# Altium schematic sheet EVB-NORA-B2_SCHEM_0002_NORA_Module.SchDoc: UBX_NORA_B1_SCHEM_0001_NORA_B1_Module
size A3; Date: 7/24/2020; CompanyName: U-blox; DrawnBy: EMOO; Engineer: EMOO; Organization: U-blox; Address1: 3950 Fairview Industrial Dr SE #100; Address2: Salem, OR 97302; DocumentNumber: 3; SheetNumber: 3; SheetTotal: 8; Website: www.u-blox.com; SheetSize: B
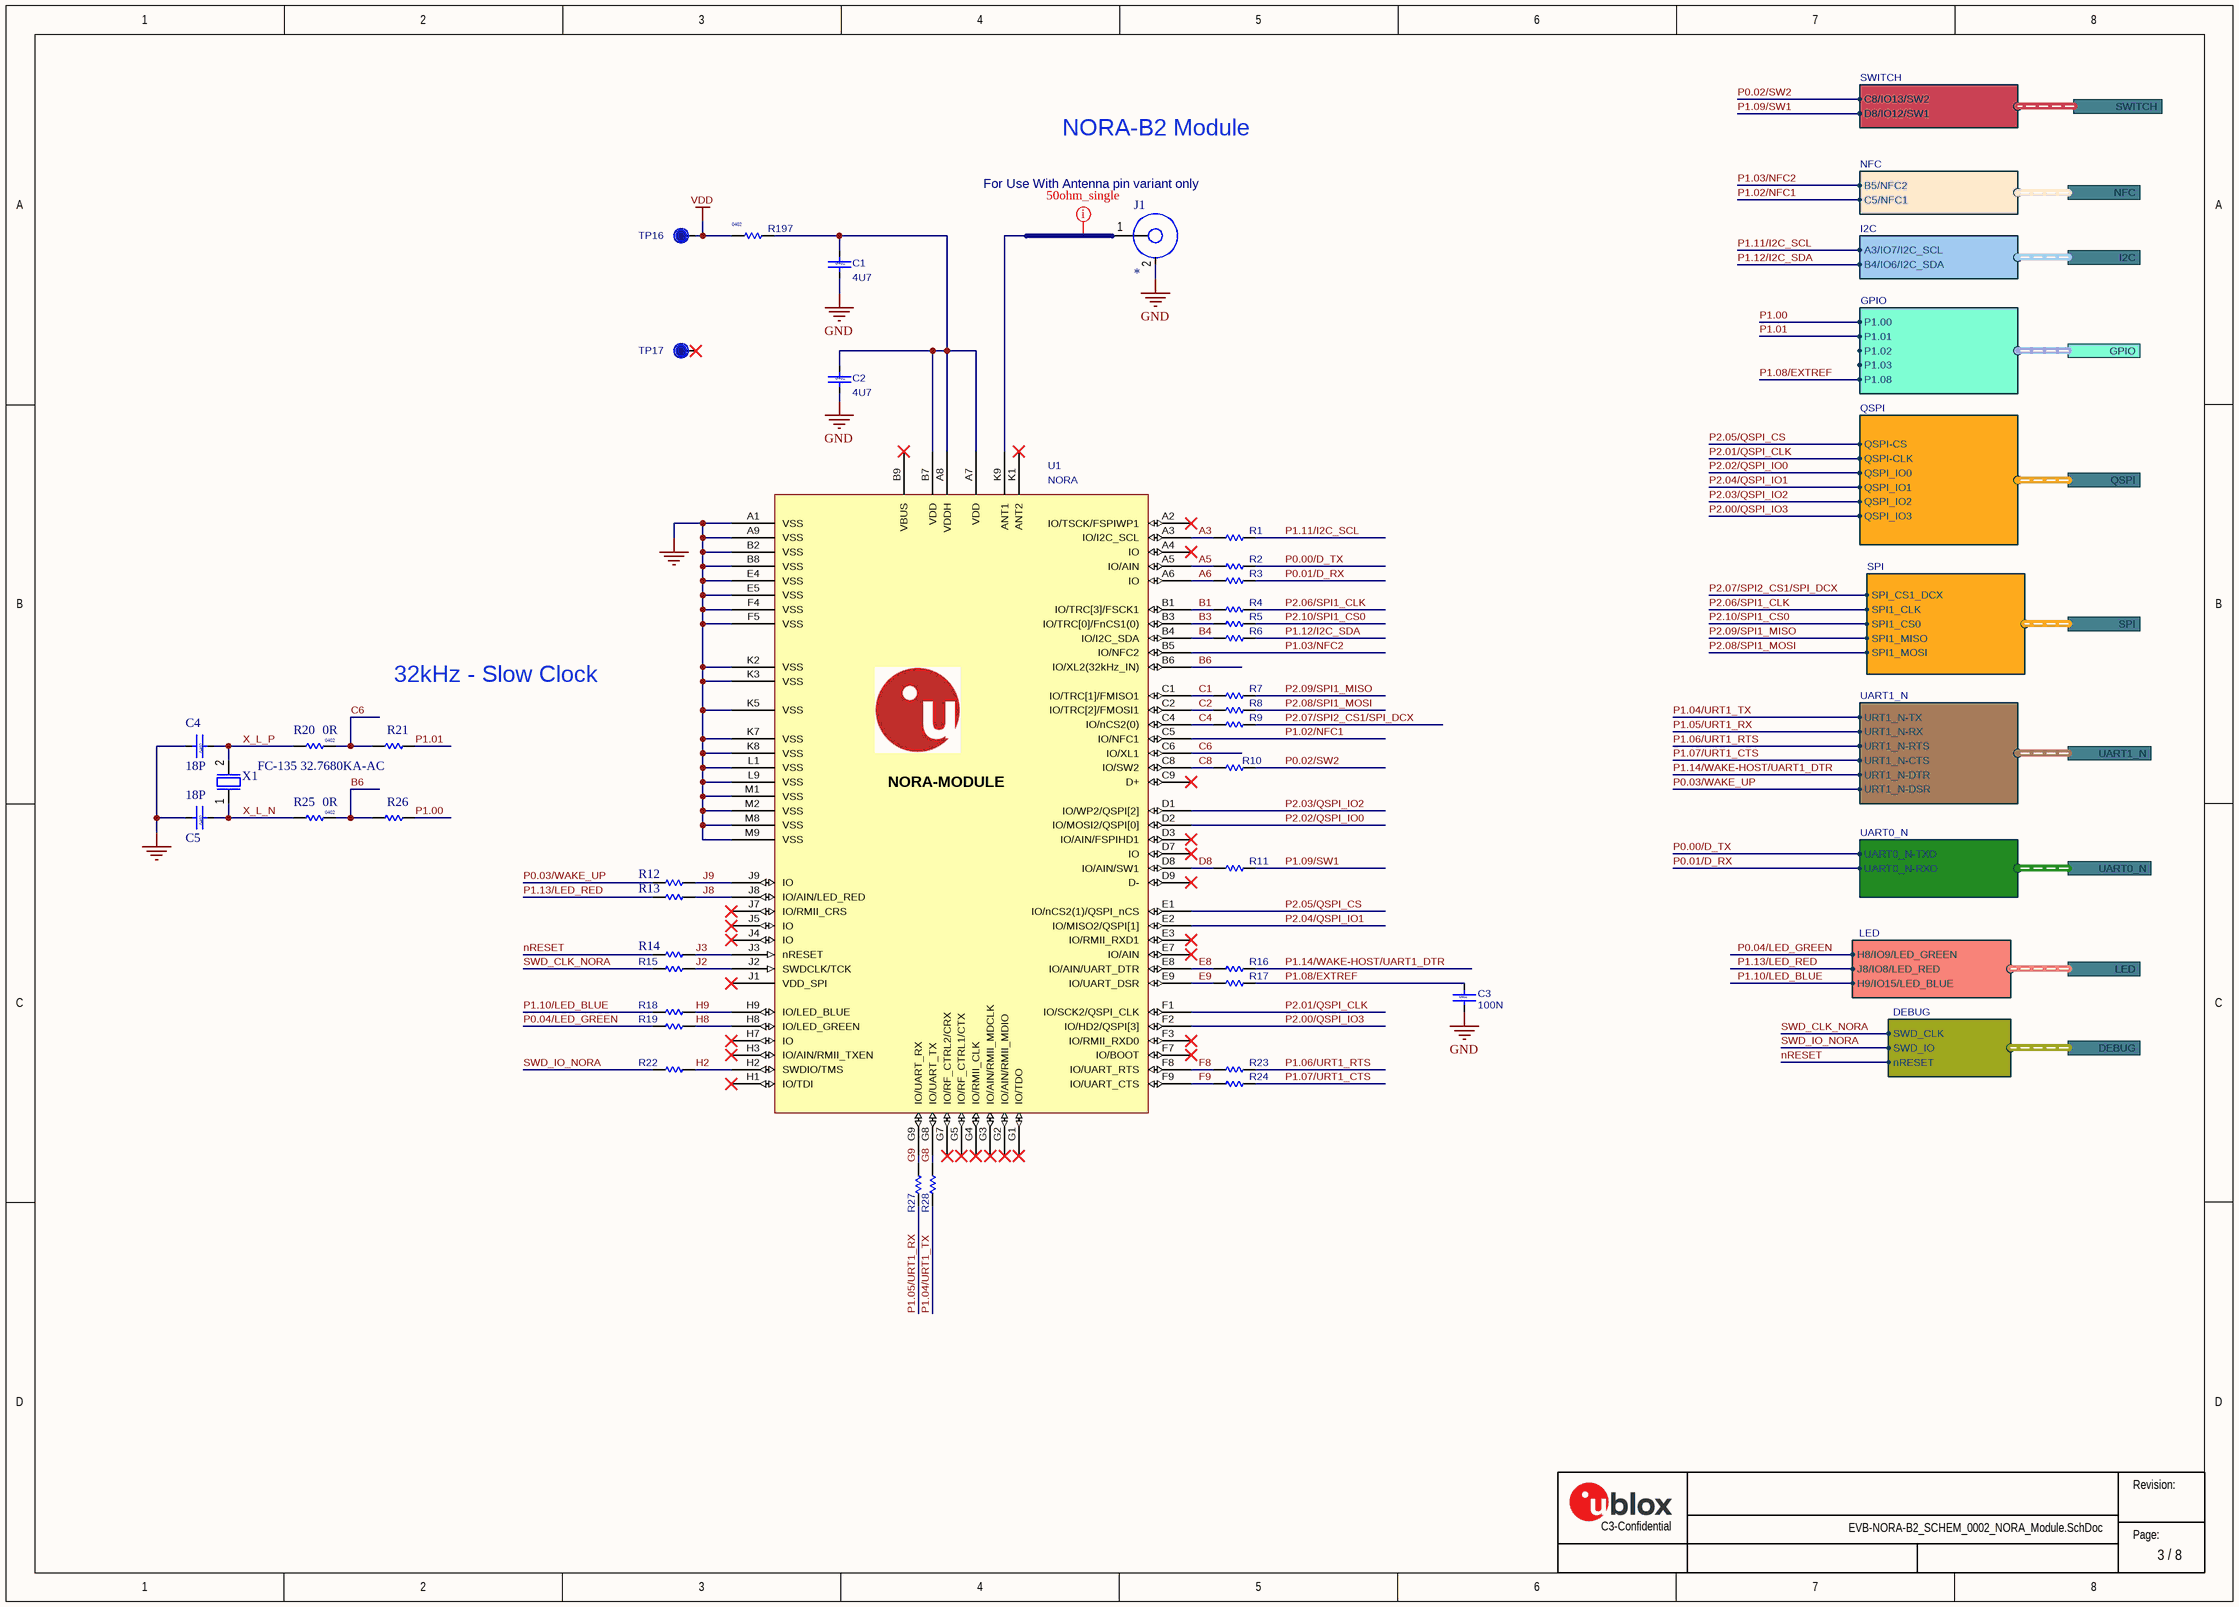
[diagram p0: EVB-NORA-B2_SCHEM_0002_NORA_Module.SchDoc]

## Parts
C1  value 4U7  Size: 0402  [Cap 0402 HD]  (hidden comment: UBXH01-0000243)
C2  value 4U7  Size: 0402  [Cap 0402 HD]  (hidden comment: UBXH01-0000243)
C3  value 100N  Size: 0402  [Cap 0402 HD]  (hidden comment: UBXH01-2021002)
C4  value 18P  Size: 0402  [Cap_0402_1100Lx600Wx600H_600x600Pad_350G_FLX]  (hidden comment: UBXH01-0004017)
C5  value 18P  Size: 0402  [Cap_0402_1100Lx600Wx600H_600x600Pad_350G_FLX]  (hidden comment: UBXH01-0004017)
J1  130-00067  [U.FL_3Pin]  (value not drawn)
R1  UBXH18-0003002  [RES 0402 HD]  (value not drawn)
R2  UBXH18-0003002  [RES 0402 HD]  (value not drawn)
R3  UBXH18-0003002  [RES 0402 HD]  (value not drawn)
R4  UBXH18-0003002  [RES 0402 HD]  (value not drawn)
R5  UBXH18-0003002  [RES 0402 HD]  (value not drawn)
R6  UBXH18-0003002  [RES 0402 HD]  (value not drawn)
R7  UBXH18-0003002  [RES 0402 HD]  (value not drawn)
R8  UBXH18-0003002  [RES 0402 HD]  (value not drawn)
R9  UBXH18-0003002  [RES 0402 HD]  (value not drawn)
R10  UBXH18-0003002  [RES 0402 HD]  (value not drawn)
R11  UBXH18-0003002  [RES 0402 HD]  (value not drawn)
R12  UBXH18-0003002  [RES_0402_1100Lx600Wx400H_500x600Pad_400G_FLX]  (value not drawn)
R13  UBXH18-0003002  [RES_0402_1100Lx600Wx400H_500x600Pad_400G_FLX]  (value not drawn)
R14  UBXH18-0003002  [RES_0402_1100Lx600Wx400H_500x600Pad_400G_FLX]  (value not drawn)
R15  UBXH18-0003002  [RES 0402 HD]  (value not drawn)
R16  UBXH18-0003002  [RES 0402 HD]  (value not drawn)
R17  UBXH18-0003002  [RES 0402 HD]  (value not drawn)
R18  UBXH18-0003002  [RES 0402 HD]  (value not drawn)
R19  UBXH18-0003002  [RES 0402 HD]  (value not drawn)
R20  value 0R  Size: 0402  [RES 0402 HD]  (hidden comment: UBXH18-0003002)
R21  UBXH18-0003002  [RES_0402_1100Lx600Wx400H_500x600Pad_400G_FLX]  (value not drawn)
R22  UBXH18-0003002  [RES 0402 HD]  (value not drawn)
R23  UBXH18-0003002  [RES 0402 HD]  (value not drawn)
R24  UBXH18-0003002  [RES 0402 HD]  (value not drawn)
R25  value 0R  Size: 0402  [RES 0402 HD]  (hidden comment: UBXH18-0003002)
R26  UBXH18-0003002  [RES_0402_1100Lx600Wx400H_500x600Pad_400G_FLX]  (value not drawn)
R27  UBXH18-0003002  [RES 0402 HD]  (value not drawn)
R28  UBXH18-0003002  [RES 0402 HD]  (value not drawn)
R197  Size: 0402  [RES 0402 HD]  (hidden comment: UBXH18-0003002)
TP16  TP10R  [TP10R]  (value not drawn)  (no BOM)
TP17  TP10R  [TP10R]  (value not drawn)  (no BOM)
U1  NORA  [NORA_LGA82R_1430X1040X180_ANT]
X1  Manufacturer P/N: FC-135 32.7680KA-AC  [XTAL_3215]  (hidden comment: UBXH21-0008104)

## Ports
DEBUG (harness Debug), GPIO (harness GPIO), I2C (harness I2C), LED (harness LED), NFC (harness NFC), QSPI (harness QSPI), SPI (harness SPI), SWITCH (harness SWITCH), UART0_N (harness UART0_N), UART1_N (harness UART1_N)

## Harnesses
DEBUG: nRESET, SWD_IO, SWD_CLK
UART1_N: URT1_N-RTS, URT1_N-CTS, URT1_N-TX, URT1_N-RX, URT1_N-DTR, URT1_N-DSR
QSPI: QSPI-CS, QSPI-CLK, QSPI_IO0, QSPI_IO1, QSPI_IO2, QSPI_IO3
LED: H9/IO15/LED_BLUE, J8/IO8/LED_RED, H8/IO9/LED_GREEN
I2C: A3/IO7/I2C_SCL, B4/IO6/I2C_SDA
NFC: B5/NFC2, C5/NFC1
SWITCH: C8/IO13/SW2, D8/IO12/SW1
GPIO: P1.00, P1.01, P1.02, P1.08, P1.03
UART0_N: UART0_N-TXD, UART0_N-RXD
SPI: SPI_CS1_DCX, SPI1_CLK, SPI1_CS0, SPI1_MISO, SPI1_MOSI

## Nets
GND: C1.2 C2.2 C3.1 C4.2 C5.2 J1.2 U1.A1(VSS) U1.A9(VSS) U1.B2(VSS) U1.B8(VSS) U1.E4(VSS) U1.E5(VSS) U1.F4(VSS) U1.F5(VSS) U1.K2(VSS) U1.K3(VSS) U1.K5(VSS) U1.K7(VSS) U1.K8(VSS) U1.L1(VSS) U1.L9(VSS) U1.M1(VSS) U1.M2(VSS) U1.M8(VSS) U1.M9(VSS)
VDD: R197.2 TP16.1
A3: R1.2 U1.A3(IO/I2C_SCL)
A5: R2.2 U1.A5(IO/AIN)
A6: R3.2 U1.A6(IO)
B1: R4.2 U1.B1(IO/TRC[3]/FSCK1)
B3: R5.2 U1.B3(IO/TRC[0]/FnCS1(0))
B4: R6.2 U1.B4(IO/I2C_SDA)
B6: R25.2 R26.2 U1.B6(IO/XL2(32kHz_IN))
C1: R7.2 U1.C1(IO/TRC[1]/FMISO1)
C2: R8.2 U1.C2(IO/TRC[2]/FMOSI1)
C4: R9.2 U1.C4(IO/nCS2(0))
C6: R20.2 R21.2 U1.C6(IO/XL1)
C8: R10.2 U1.C8(IO/SW2)
D8: R11.2 U1.D8(IO/AIN/SW1)
E8: R16.2 U1.E8(IO/AIN/UART_DTR)
E9: R17.2 U1.E9(IO/UART_DSR)
F8: R23.2 U1.F8(IO/UART_RTS)
F9: R24.2 U1.F9(IO/UART_CTS)
G8: R28.1 U1.G8(IO/UART_TX)
G9: R27.1 U1.G9(IO/UART_RX)
H2: R22.1 U1.H2(SWDIO/TMS)
H8: R19.1 U1.H8(IO/LED_GREEN)
H9: R18.1 U1.H9(IO/LED_BLUE)
J2: R15.1 U1.J2(SWDCLK/TCK)
J3: R14.1 U1.J3(nRESET)
J8: R13.1 U1.J8(IO/AIN/LED_RED)
J9: R12.1 U1.J9(IO)
nRESET: R14.2 ; port DEBUG.nRESET
P0.00/D_TX: R2.1 ; port UART0_N.UART0_N-TXD
P0.01/D_RX: R3.1 ; port UART0_N.UART0_N-RXD
P0.02/SW2: R10.1 ; port SWITCH.C8/IO13/SW2
P0.03/WAKE_UP: R12.2 ; port UART1_N.URT1_N-DSR
P0.04/LED_GREEN: R19.2 ; port LED.H8/IO9/LED_GREEN
P1.00: R26.1 ; port GPIO.P1.00
P1.01: R21.1 ; port GPIO.P1.01
P1.02/NFC1: U1.C5(IO/NFC1) ; port NFC.C5/NFC1
P1.03/NFC2: U1.B5(IO/NFC2) ; port NFC.B5/NFC2
P1.04/URT1_TX: R28.2 ; port UART1_N.URT1_N-TX
P1.05/URT1_RX: R27.2 ; port UART1_N.URT1_N-RX
P1.06/URT1_RTS: R23.1 ; port UART1_N.URT1_N-RTS
P1.07/URT1_CTS: R24.1 ; port UART1_N.URT1_N-CTS
P1.08/EXTREF: C3.2 R17.1 ; port GPIO.P1.08
P1.09/SW1: R11.1 ; port SWITCH.D8/IO12/SW1
P1.10/LED_BLUE: R18.2 ; port LED.H9/IO15/LED_BLUE
P1.11/I2C_SCL: R1.1 ; port I2C.A3/IO7/I2C_SCL
P1.12/I2C_SDA: R6.1 ; port I2C.B4/IO6/I2C_SDA
P1.13/LED_RED: R13.2 ; port LED.J8/IO8/LED_RED
P1.14/WAKE-HOST/UART1_DTR: R16.1 ; port UART1_N.URT1_N-DTR
P2.00/QSPI_IO3: U1.F2(IO/HD2/QSPI[3]) ; port QSPI.QSPI_IO3
P2.01/QSPI_CLK: U1.F1(IO/SCK2/QSPI_CLK) ; port QSPI.QSPI-CLK
P2.02/QSPI_IO0: U1.D2(IO/MOSI2/QSPI[0]) ; port QSPI.QSPI_IO0
P2.03/QSPI_IO2: U1.D1(IO/WP2/QSPI[2]) ; port QSPI.QSPI_IO2
P2.04/QSPI_IO1: U1.E2(IO/MISO2/QSPI[1]) ; port QSPI.QSPI_IO1
P2.05/QSPI_CS: U1.E1(IO/nCS2(1)/QSPI_nCS) ; port QSPI.QSPI-CS
P2.06/SPI1_CLK: R4.1 ; port SPI.SPI1_CLK
P2.07/SPI2_CS1/SPI_DCX: R9.1 ; port SPI.SPI_CS1_DCX
P2.08/SPI1_MOSI: R8.1 ; port SPI.SPI1_MOSI
P2.09/SPI1_MISO: R7.1 ; port SPI.SPI1_MISO
P2.10/SPI1_CS0: R5.1 ; port SPI.SPI1_CS0
SWD_CLK_NORA: R15.2 ; port DEBUG.SWD_CLK
SWD_IO_NORA: R22.2 ; port DEBUG.SWD_IO
X_L_N: C5.1 R25.1 X1.1
X_L_P: C4.1 R20.1 X1.2
NetC1_1: C1.1 C2.1 R197.1 U1.A7(VDD) U1.A8(VDDH) U1.B7(VDD)
NetJ1_1: J1.1(ANT) U1.K9(ANT1)

Not connected (* = marked no-connect by the designer): TP17 1*; U1 A2(IO/TSCK/FSPIWP1)* A4(IO)* B9(VBUS)* C9(D+)* D3(IO/AIN/FSPIHD1)* D7(IO)* D9(D-)* E3(IO/RMII_RXD1)* E7(IO/AIN)* F3(IO/RMII_RXD0)* F7(IO/BOOT)* G1(IO/TDO)* G2(IO/AIN/RMII_MDIO)* G3(IO/AIN/RMII_MDCLK)* G4(IO/RMII_CLK)* G5(IO/RF_CTRL1/CTX)* G7(IO/RF_CTRL2/CRX)* H1(IO/TDI)* H3(IO/AIN/RMII_TXEN)* H7(IO)* J1(VDD_SPI)* J4(IO)* J5(IO)* J7(IO/RMII_CRS)* K1(ANT2)*

## Layout directives
net class 50_ohm_se: NetJ1_1

## Notes on the sheet
- (near J1) For Use With Antenna pin variant only
- NORA-B2 Module
- 32kHz - Slow Clock
- Revision:
- C3-Confidential
- Page:
- (in symbol NORA-MODULE_ALT) NORA-MODULE

## Library data of the parts
C1 C2 = UBXH01-0000243: CAP CER X5R 0402 4U7 20% 10V; Manufacturer: Murata Manufacturing Company, Ltd.; Manufacturer P/N: GRM155R61A475MEAA; Editor: martin.pilik; Released by: fabrice.bret-dibat; Env: GREEN; Permitted Use: Volume Products; Perferred: PREF; Mfg P/N Status: Active; Mfg P/N Split: 100; Mfg P/N Released: Yes; Part Number: UBXH01-0000243; Tolerance: 20%; Max Voltage: 10V; Min Operating Temp: -40°C; Max Operating Temp: 85°C; Part Type: Capacitor; Release Data: 2021-05-10 12:57:47.325652; UBX Wiki: https://wiki.u-blox.com/bin/view/Operations/PartDetails?index=24303; RefDes: C; Mfg P/N Datasheet: https://wiki.u-blox.com/bin/view/Generic/Docs/DocumentSummary?index=24302
C3 = UBXH01-2021002: CAP CER X5R 0402 100N 10% 10V; Manufacturer: Murata Manufacturing Company, Ltd.; Manufacturer P/N: GRM155R61A104KA01; Editor: roland.rust; Env: GREEN; Permitted Use: Volume Products; Perferred: PREF; Mfg P/N Status: NRND; Mfg P/N Split: 100; Mfg P/N Released: Yes; Part Number: UBXH01-2021002; Tolerance: 10%; Max Voltage: 10V; Part Type: Capacitor; Released by: roland.rust; Release Data: 2005-07-22T13:59:44; UBX Wiki: https://wiki.u-blox.com/bin/view/Operations/PartDetails?index=5759; RefDes: C; Manufacturer 2: Samsung Electro-Mechanics; Manufacturer P/N 2: CL05A104KP5NNN; Mfg P/N Status 2: Active; Mfg P/N Split 2: 0; Mfg P/N Released 2: Yes; Mfg P/N Datasheet 2: https://wiki.u-blox.com/bin/view/Generic/Docs/DocumentSummary?index=28113
C4 C5 = UBXH01-0004017: CAP CER C0G 0402 18P 5% 25V; Manufacturer: Murata Manufacturing Company, Ltd.; Manufacturer P/N: GRM1555C1H180JA01; Editor: doris.zahnd; Env: ROHS; Permitted Use: Volume Products; Perferred: PREF; Mfg P/N Status: NRND; Mfg P/N Split: 100; Mfg P/N Released: Yes; Released by: daniel.hurni; Part Number: UBXH01-0004017; Tolerance: 5%; Max Voltage: 25V; Min Operating Temp: -55°C; Max Operating Temp: 125°C; Part Type: Capacitor; UBX Wiki: https://wiki.u-blox.com/bin/view/Operations/PartDetails?index=5178; RefDes: C; Release Data: 2009-12-03T17:48:42; Manufacturer 2: Murata Manufacturing Company, Ltd.; Manufacturer P/N 2: GRM1555C1E180JZ01; Mfg P/N Status 2: Obsolete; Mfg P/N Split 2: 0; Mfg P/N Released 2: Yes; Manufacturer 3: Murata Manufacturing Company, Ltd.; Manufacturer P/N 3: GRM1555C1H180JZ01; Mfg P/N Status 3: Obsolete; Mfg P/N Split 3: 0; Mfg P/N Released 3: Yes
J1 = 130-00067: U.FL jack, SMA 50 ohm, 3 pin, SMT; Part Name: CON RF UMC U.FL Jack 3Pin SMT; Manufacturer 1: Hirose Electric Co Ltd; Manufacturer Part Number 1: U.FL-R-SMT(10); Use in new designs: Yes; UBX Code: UBXH04-0001026; Voltage: None; Item Phase: In Production; Manufacturer P/N: *; Part Number: 130-00067; Revision: 0A; Supplier 1: Digi-Key; Supplier Part Number 1: H9161CT-ND; Manufacturer 2: Dongguan Qintai Electronics Co, Ltd.; Supplier 2: Rayson Technology co., ltd; Supplier Part Number 2: MHF-RT-1; Height: 1.25mm; Pins: 3; Max Operating Temp: 90; Diameter: None; Min Operating Temp: -40; Manufacturer Part Number 2: MHF-RT-1
R1-R11 R15-R19 R22-R24 R27 R28 R197 = UBXH18-0003002: RES THICK FILM CHIP 0402 0R 0 100mW; Manufacturer: KOA; Manufacturer P/N: RK73Z1ETTP; Tolerance: 0; Editor: charlotte.biber; Released by: peter.mueller; Env: ROHS; Permitted Use: Volume Products; Perferred: PREF; Mfg P/N Status: NRND; Mfg P/N Split: 100; Mfg P/N Released: Yes; Value: 0R; Part Number: UBXH18-0003002; Max Power: 100mW; Part Type: Resistor; Release Data: 2012-06-05 09:49:55.978616; UBX Wiki: https://wiki.u-blox.com/bin/view/Operations/PartDetails?index=6611; RefDes: R; Manufacturer 2: YAGEO; Manufacturer P/N 2: 2322_705_91001_L; Mfg P/N Status 2: NRND; Mfg P/N Split 2: 0; Mfg P/N Released 2: Yes
  R1-R11 R15-R19 R22-R24 R27 R28: Size: 0402
R12-R14 R20 R21 R25 R26 = UBXH18-0003002: RES THICK FILM CHIP 0402 0R 0 100mW; Manufacturer: KOA; Manufacturer P/N: RK73Z1ETTD; Tolerance: 0; Editor: charlotte.biber; Released by: peter.mueller; Env: ROHS; Permitted Use: Volume Products; Perferred: PREF; Mfg P/N Status: NRND; Mfg P/N Split: 100; Mfg P/N Released: Yes; Part Number: UBXH18-0003002; Part Type: Resistor; UBX Wiki: https://wiki.u-blox.com/bin/view/Operations/PartDetails?index=6611; RefDes: R; Manufacturer 2: YAGEO; Manufacturer P/N 2: 2322_705_91001_L; Mfg P/N Split 2: 0; Mfg P/N Released 2: Yes; Max Power: 100mW
  R12-R14 R21 R26: Value: 0R; Size: 0402; Release Data: 2012-06-05T09:49:55; Mfg P/N Status 2: Obsolete
  R20 R25: Release Data: 2012-06-05 09:49:55.978616; Mfg P/N Status 2: NRND
TP16 TP17 = TP10R: Testpoint, Round 1.0mm Dia; Added By: Jeremy D; Part Number: TP10R; Size: 1.0mm; Height: 0; DNP: DNP; Added Date: 2/1/2015; Checked By: Paul B; Checked Date: 2/5/2015
U1 = NORA-MODULE_ALT: u-blox NORA module generic symbol for use within module designs - alternate version; Part Description: NORA MODULE FOOTPRINT; Body Size: 14.3 mm x 10.4 mm; Manufacturer P/N: NORA; Part Number: NORA; Part Name: NORA; Part_Type: Module; Manufacturer: u-blox; Height: 0; Value: NORA
X1 = UBXH21-0008104: CRYSTAL CL=9PF EPSON FC-135 NI/SN TERMINATION 32.768KHz; Part Phase: Unreleased; Use in new designs: No; Environmental Grade: RoHS; Frequency Tolerance: 20PPM; Owner: Andreas Thiel; Volume Use: Yes; Part Number: UBXH21-0008104; Part Name: CRYSTAL CL=9PF EPSON FC-135 NI/SN TERMINATION; Automotive: No; ComponentLink1Description: Arena Link; ComponentLink1URL: https://app.bom.com/6O8RWKSUOQ9H0EE2EEBI; Frequency: 32.768KHz; Part Status: Non-Preferred; Part Type: Crystal